# Altium schematic sheet Mother_board_main.SchDoc
size 410 x 297 mm
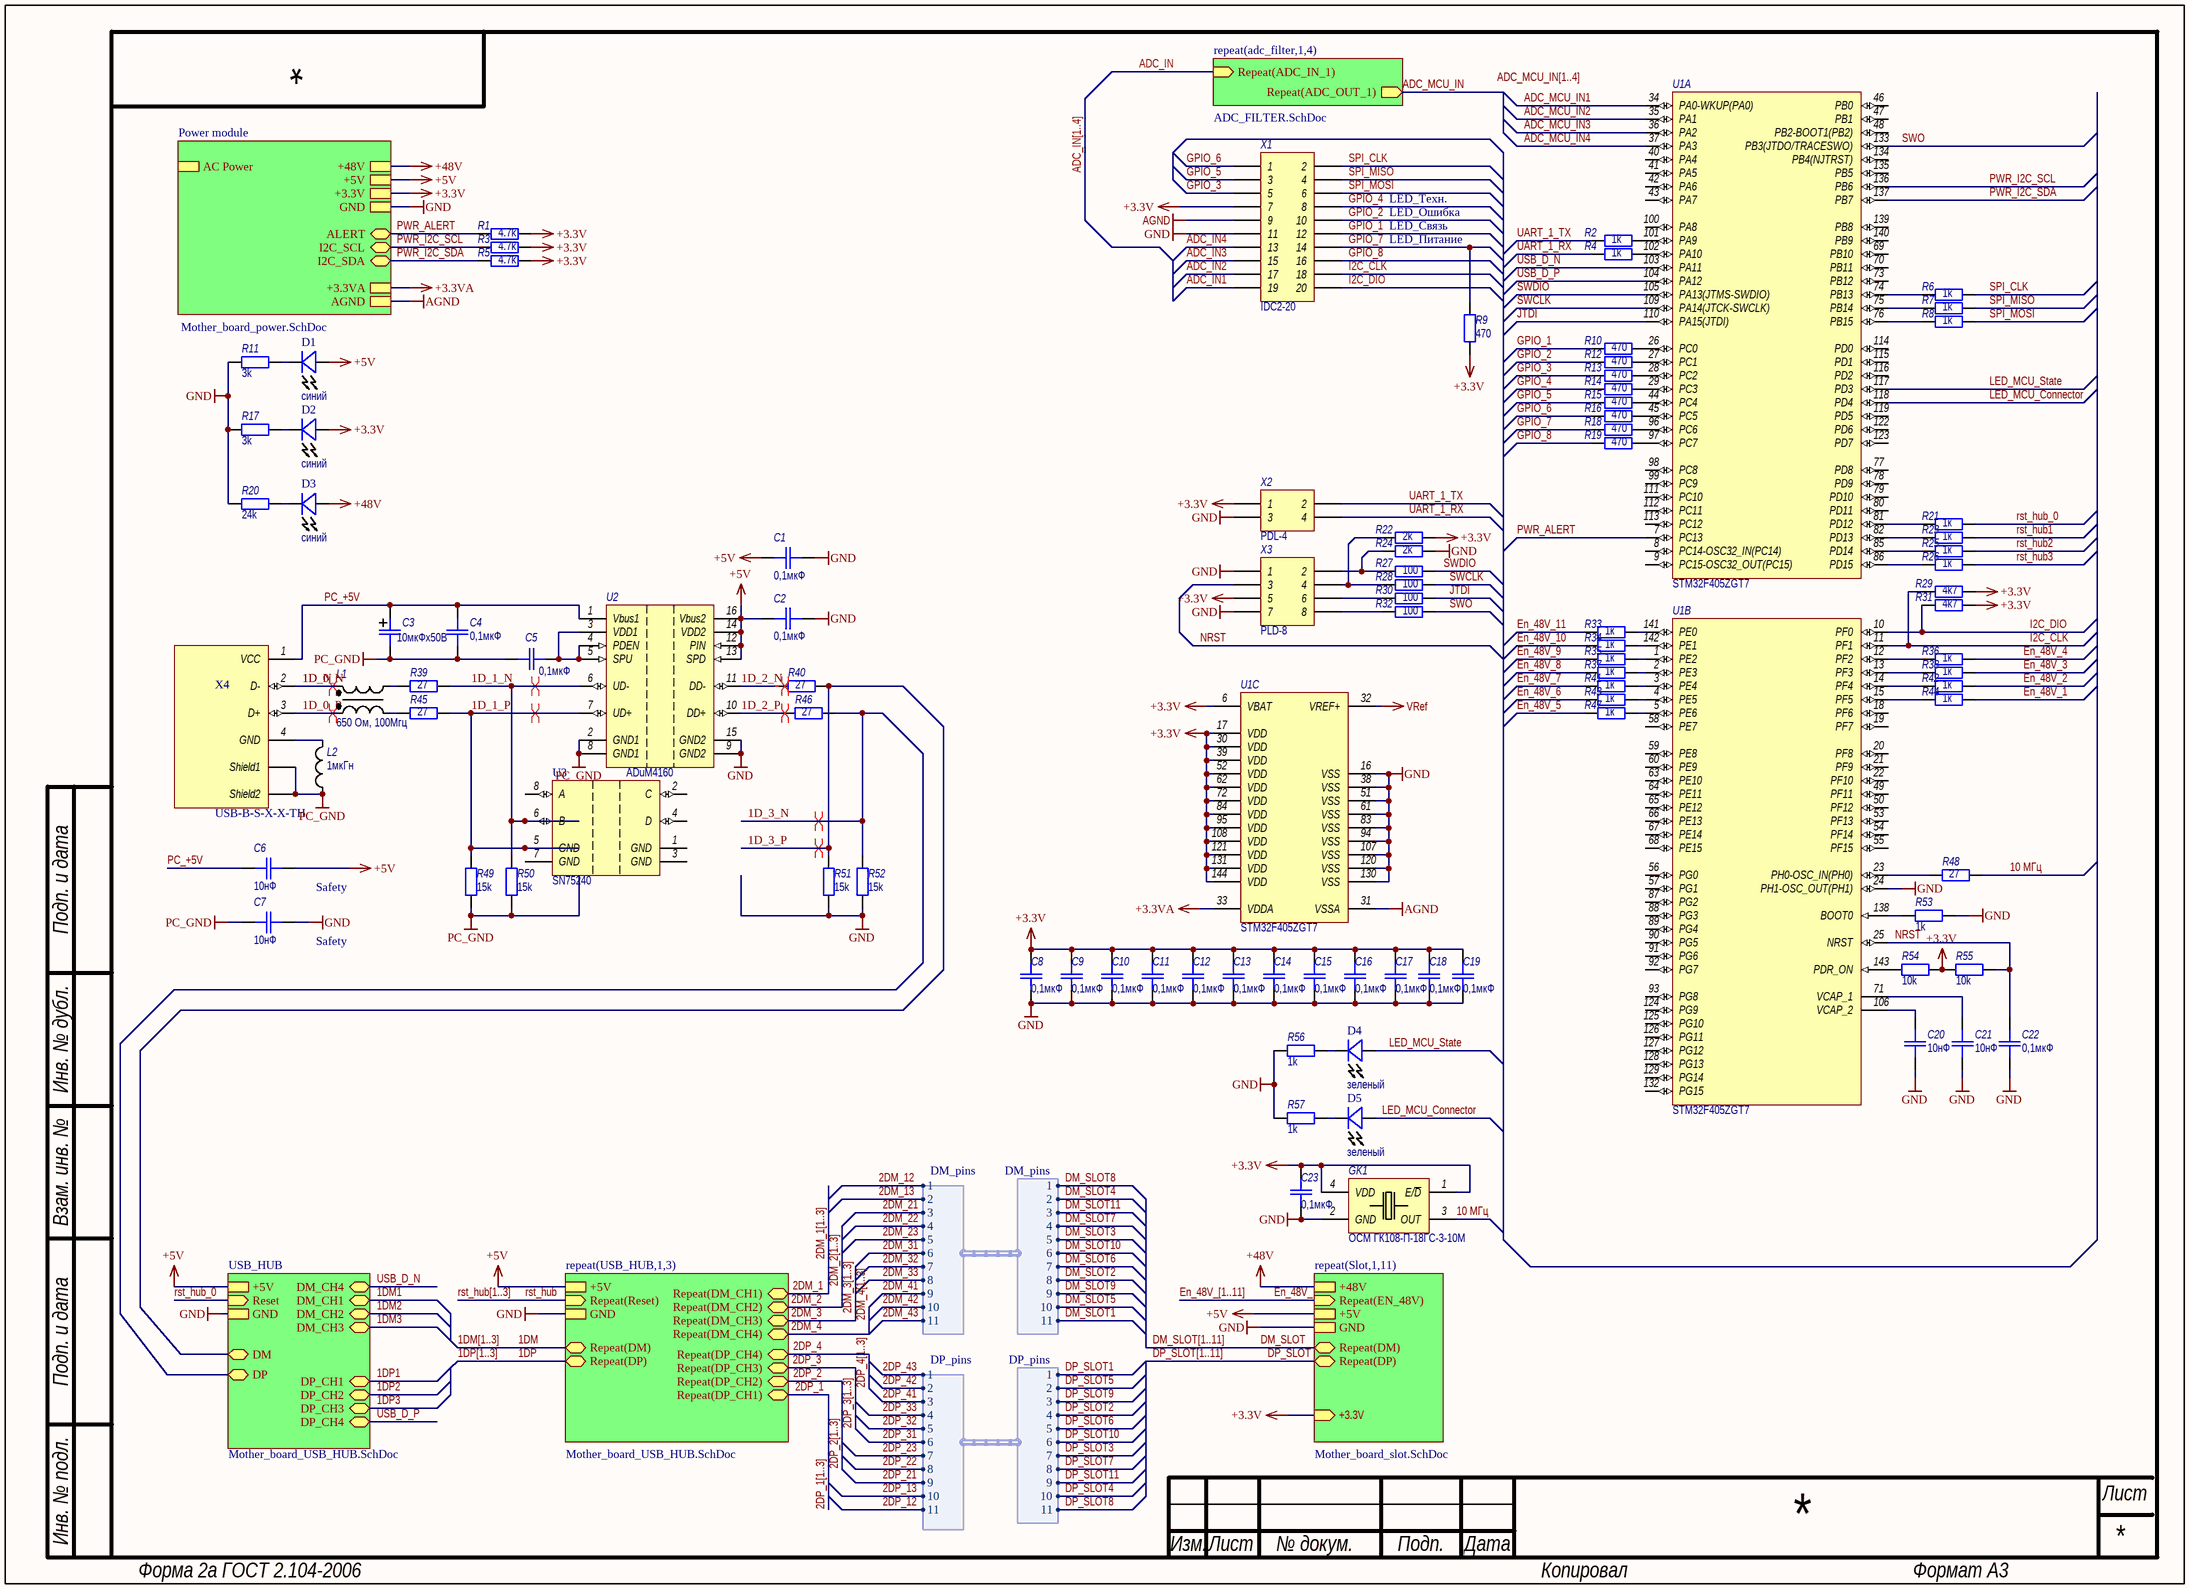
[diagram p0: Mother_board_main.SchDoc]

## Parts
C1  0,1мкФ  [SMD_0805]
C2  0,1мкФ  [SMD_0805]
C3  10мкФх50В  [SMD_size_B]
C4  0,1мкФ  [SMD_0805]
C5  0,1мкФ  [SMD_0805]
C6  10нФ  [SMD_0805]
C7  10нФ  [SMD_0805]
C8  0,1мкФ  [SMD_0805]
C9  0,1мкФ  [SMD_0805]
C10  0,1мкФ  [SMD_0805]
C11  0,1мкФ  [SMD_0805]
C12  0,1мкФ  [SMD_0805]
C13  0,1мкФ  [SMD_0805]
C14  0,1мкФ  [SMD_0805]
C15  0,1мкФ  [SMD_0805]
C16  0,1мкФ  [SMD_0805]
C17  0,1мкФ  [SMD_0805]
C18  0,1мкФ  [SMD_0805]
C19  0,1мкФ  [SMD_0805]
C20  10нФ  [SMD_0805]
C21  10нФ  [SMD_0805]
C22  0,1мкФ  [SMD_0805]
C23  0,1мкФ  [SMD_0805]
D1  value синий  [LED-0805]  (hidden comment: LED)
D2  value синий  [LED-0805]  (hidden comment: LED)
D3  value синий  [LED-0805]  (hidden comment: LED)
D4  value зеленый  [LED-0805+circle]  (hidden comment: LED)
D5  value зеленый  [LED-0805+circle]  (hidden comment: LED)
GK1  Наименование: ОСМ ГК108-П-18ГС-3-10М  [SMD_7050_Crystal_Oscillator]  (hidden comment: GK108-P)
L1  650 Ом, 100Мгц  [ACM2012]
L2  1мкГн  [SMD_0805]
R1  4.7k  [SMD_0805]
R2  1k  [SMD_0805]
R3  4.7k  [SMD_0805]
R4  1k  [SMD_0805]
R5  4.7k  [SMD_0805]
R6  1k  [SMD_0805]
R7  1k  [SMD_0805]
R8  1k  [SMD_0805]
R9  470  [SMD_0805]
R10  470  [SMD_0805]
R11  3k  [SMD_0805]
R12  470  [SMD_0805]
R13  470  [SMD_0805]
R14  470  [SMD_0805]
R15  470  [SMD_0805]
R16  470  [SMD_0805]
R17  3k  [SMD_0805]
R18  470  [SMD_0805]
R19  470  [SMD_0805]
R20  24k  [SMD_0805]
R21  1к  [SMD_0805]
R22  2k  [SMD_0805]
R23  1к  [SMD_0805]
R24  2k  [SMD_0805]
R25  1к  [SMD_0805]
R26  1к  [SMD_0805]
R27  100  [SMD_0805]
R28  100  [SMD_0805]
R29  4k7  [SMD_0805]
R30  100  [SMD_0805]
R31  4k7  [SMD_0805]
R32  100  [SMD_0805]
R33  1к  [SMD_0805]
R34  1к  [SMD_0805]
R35  1к  [SMD_0805]
R36  1к  [SMD_0805]
R37  1к  [SMD_0805]
R38  1к  [SMD_0805]
R39  27  [SMD_0805]
R40  27  [SMD_0805]
R41  1к  [SMD_0805]
R42  1к  [SMD_0805]
R43  1к  [SMD_0805]
R44  1к  [SMD_0805]
R45  27  [SMD_0805]
R46  27  [SMD_0805]
R47  1к  [SMD_0805]
R48  27  [SMD_0805]
R49  15k  [SMD_0805]
R50  15k  [SMD_0805]
R51  15k  [SMD_0805]
R52  15k  [SMD_0805]
R53  1k  [SMD_0805]
R54  10k  [SMD_0805]
R55  10k  [SMD_0805]
R56  1k  [SMD_0805]
R57  1k  [SMD_0805]
U1  STM32F405ZGT7  [LQFP144]  (parts A,B,C of 3)
U2  ADuM1402  [SOIC-16-WIDE]  (value not drawn)
U3  SN75240  [SN75240]
X1  Наименование: IDC2-20  [PLD2-20]  (hidden comment: Header 2X20)
X2  Наименование: PDL-4  [PBD-4]  (hidden comment: Header 2X4)
X3  Наименование: PLD-8  [PBD-8]  (hidden comment: Header 2X8)
X4  USB-B-S-X-X-TH  [*SAMTEC_USB-B-S-X-X-TH_USB-B-S-X-X-TH(Primary)]

## Sub-sheets
Power module = Mother_board_power.SchDoc: AC Power (harness AC Power), I2C_SCL (bidir), I2C_SDA (bidir), ALERT (bidir), +5V, +48V, +3.3V, GND, +3.3VA, AGND
repeat(adc_filter,1,4) = ADC_FILTER.SchDoc: Repeat(ADC_OUT_1) (out), Repeat(ADC_IN_1) (in)
repeat(Slot,1,11) = Mother_board_slot.SchDoc: Repeat(DM) (bidir), Repeat(EN_48V) (in), Repeat(DP) (bidir), +48V, +5V, GND, +3.3V (in)
repeat(USB_HUB,1,3) = Mother_board_USB_HUB.SchDoc: Repeat(Reset) (in), Repeat(DP) (bidir), Repeat(DM) (bidir), Repeat(DP_CH1) (bidir), Repeat(DP_CH2) (bidir), Repeat(DP_CH3) (bidir), Repeat(DP_CH4) (bidir), Repeat(DM_CH1) (bidir), Repeat(DM_CH2) (bidir), Repeat(DM_CH3) (bidir), Repeat(DM_CH4) (bidir), +5V, GND
USB_HUB = Mother_board_USB_HUB.SchDoc: Reset (in), DP (bidir), DM (bidir), DP_CH1 (bidir), DP_CH2 (bidir), DP_CH3 (bidir), DP_CH4 (bidir), DM_CH1 (bidir), DM_CH2 (bidir), DM_CH3 (bidir), DM_CH4 (bidir), GND, +5V

## Harnesses
DM_pins: 1, 2, 3, 4, 5, 6, 7, 8, 9, 10, 11
DP_pins: 1, 2, 3, 4, 5, 6, 7, 8, 9, 10, 11

## Nets
+3.3V: C8.2 C9.2 C10.2 C11.2 C12.2 C13.2 C14.2 C15.2 C16.2 C17.2 C18.2 C19.2 C23.2 D2.1(A) GK1.1(E/~{D}) GK1.4(VDD) R1.1 R3.1 R5.1 R9.1 R22.2 R29.2 R31.2 R54.1 R55.2 U1.6(VBAT) U1.17(VDD) U1.30(VDD) U1.39(VDD) U1.52(VDD) U1.62(VDD) U1.72(VDD) U1.84(VDD) U1.95(VDD) U1.108(VDD) U1.121(VDD) U1.131(VDD) U1.144(VDD) X1.7 X2.1 X3.5 ; sheet Power module/+3.3V, sheet repeat(Slot,1,11)/+3.3V
+3.3VA: U1.33(VDDA) ; sheet Power module/+3.3VA
+5V: C1.2 C2.2 C6.2 D1.1(A) U2.12(PIN) U2.13(SPD) U2.14(VDD2) U2.16(Vbus2) ; sheet Power module/+5V, sheet repeat(USB_HUB,1,3)/+5V, sheet repeat(Slot,1,11)/+5V, sheet USB_HUB/+5V
+48V: D3.1(A) ; sheet Power module/+48V, sheet repeat(Slot,1,11)/+48V
AGND: U1.31(VSSA) X1.9 ; sheet Power module/AGND
GND: C1.1 C2.1 C7.2 C8.1 C9.1 C10.1 C11.1 C12.1 C13.1 C14.1 C15.1 C16.1 C17.1 C18.1 C19.1 C20.1 C21.1 C22.1 C23.1 GK1.2(GND) R11.1 R17.1 R20.1 R24.2 R51.2 R52.2 R53.1 R56.1 R57.1 U1.16(VSS) U1.24(PH1-OSC_OUT(PH1)) U1.38(VSS) U1.51(VSS) U1.61(VSS) U1.83(VSS) U1.94(VSS) U1.107(VSS) U1.120(VSS) U1.130(VSS) U2.9(GND2) U2.15(GND2) X1.11 X2.3 X3.1 X3.7 ; sheet Power module/GND, sheet repeat(USB_HUB,1,3)/GND, sheet repeat(Slot,1,11)/GND, sheet USB_HUB/GND
PC_GND: C3.2 C4.2 C5.1 C7.1 L2.1 R49.1 R50.1 U2.2(GND1) U2.8(GND1) X4.S1(Shield1) X4.S2(Shield2)
VRef: U1.32(VREF+)
1D_0_N: L1.2 X4.2(D-)  [also labelled 1D_N]
1D_0_P: L1.3 X4.3(D+)
1D_1_N: R39.2 R50.2 U2.6(UD-) U3.6(B)
1D_1_P: R45.2 R49.2 U2.7(UD+) U3.5(GND)
1D_2_N: R40.1 U2.11(DD-)
1D_2_P: R46.1 U2.10(DD+)
1D_3_N: R46.2 R52.1 ; sheet USB_HUB/DP
1D_3_P: R40.2 R51.1 ; sheet USB_HUB/DM
1DM: sheet repeat(USB_HUB,1,3)/Repeat(DM)
1DM1: sheet USB_HUB/DM_CH1
1DM2: sheet USB_HUB/DM_CH2
1DM3: sheet USB_HUB/DM_CH3
1DP: sheet repeat(USB_HUB,1,3)/Repeat(DP)
1DP1: sheet USB_HUB/DP_CH1
1DP2: sheet USB_HUB/DP_CH2
1DP3: sheet USB_HUB/DP_CH3
2DM_1: sheet repeat(USB_HUB,1,3)/Repeat(DM_CH1)
2DM_2: sheet repeat(USB_HUB,1,3)/Repeat(DM_CH2)
2DM_3: sheet repeat(USB_HUB,1,3)/Repeat(DM_CH3)
2DM_4: sheet repeat(USB_HUB,1,3)/Repeat(DM_CH4)
2DM_12: harness DM_pins.1  [also labelled DM_SLOT8]
2DM_13: harness DM_pins.2  [also labelled DM_SLOT4]
2DM_21: harness DM_pins.3  [also labelled DM_SLOT11]
2DM_22: harness DM_pins.4  [also labelled DM_SLOT7]
2DM_23: harness DM_pins.5  [also labelled DM_SLOT3]
2DM_31: harness DM_pins.6  [also labelled DM_SLOT10]
2DM_32: harness DM_pins.7  [also labelled DM_SLOT6]
2DM_33: harness DM_pins.8  [also labelled DM_SLOT2]
2DM_41: harness DM_pins.9  [also labelled DM_SLOT9]
2DM_42: harness DM_pins.10  [also labelled DM_SLOT5]
2DM_43: harness DM_pins.11  [also labelled DM_SLOT1]
2DP_1: sheet repeat(USB_HUB,1,3)/Repeat(DP_CH1)
2DP_2: sheet repeat(USB_HUB,1,3)/Repeat(DP_CH2)
2DP_3: sheet repeat(USB_HUB,1,3)/Repeat(DP_CH3)
2DP_4: sheet repeat(USB_HUB,1,3)/Repeat(DP_CH4)
2DP_12: harness DP_pins.11  [also labelled DP_SLOT8]
2DP_13: harness DP_pins.10  [also labelled DP_SLOT4]
2DP_21: harness DP_pins.9  [also labelled DP_SLOT11]
2DP_22: harness DP_pins.8  [also labelled DP_SLOT7]
2DP_23: harness DP_pins.7  [also labelled DP_SLOT3]
2DP_31: harness DP_pins.6  [also labelled DP_SLOT10]
2DP_32: harness DP_pins.5  [also labelled DP_SLOT6]
2DP_33: harness DP_pins.4  [also labelled DP_SLOT2]
2DP_41: harness DP_pins.3  [also labelled DP_SLOT9]
2DP_42: harness DP_pins.2  [also labelled DP_SLOT5]
2DP_43: harness DP_pins.1  [also labelled DP_SLOT1]
10 МГц: GK1.3(OUT) R48.1
ADC_IN: sheet repeat(adc_filter,1,4)/Repeat(ADC_IN_1)
ADC_IN1: X1.19
ADC_IN2: X1.17
ADC_IN3: X1.15
ADC_IN4: X1.13
ADC_MCU_IN: sheet repeat(adc_filter,1,4)/Repeat(ADC_OUT_1)
ADC_MCU_IN1: U1.34(PA0-WKUP(PA0))
ADC_MCU_IN2: U1.35(PA1)
ADC_MCU_IN3: U1.36(PA2)
ADC_MCU_IN4: U1.37(PA3)
DM_SLOT: sheet repeat(Slot,1,11)/Repeat(DM)
DP_SLOT: sheet repeat(Slot,1,11)/Repeat(DP)
En_48V_: sheet repeat(Slot,1,11)/Repeat(EN_48V)  [also labelled En_48V_[1..11]]
En_48V_1: R44.1
En_48V_2: R42.1
En_48V_3: R38.1
En_48V_4: R36.1
En_48V_5: R47.2
En_48V_6: R43.2
En_48V_7: R41.2
En_48V_8: R37.2
En_48V_9: R35.2
En_48V_10: R34.2
En_48V_11: R33.2
GPIO_1: R10.1 X1.12
GPIO_2: R12.1 X1.10
GPIO_3: R13.1 X1.5
GPIO_4: R14.1 X1.8
GPIO_5: R15.1 X1.3
GPIO_6: R16.1 X1.1
GPIO_7: R9.2 R18.1 X1.14
GPIO_8: R19.1 X1.16
I2C_CLK: R29.1 U1.11(PF1) X1.18
I2C_DIO: R31.1 U1.10(PF0) X1.20
JTDI: R30.2 U1.110(PA15(JTDI))
LED_MCU_Connector: D5.1(A) U1.118(PD4)
LED_MCU_State: D4.1(A) U1.117(PD3)
NRST: C22.2 R55.1 U1.25(NRST) X3.3
PC_+5V: C3.1 C4.1 C6.1 U2.1(Vbus1) X4.1(VCC)
PWR_ALERT: R1.2 U1.7(PC13) ; sheet Power module/ALERT
PWR_I2C_SCL: R3.2 U1.136(PB6) ; sheet Power module/I2C_SCL
PWR_I2C_SDA: R5.2 U1.137(PB7) ; sheet Power module/I2C_SDA
rst_hub: sheet repeat(USB_HUB,1,3)/Repeat(Reset)
rst_hub1: R23.1
rst_hub2: R25.1
rst_hub3: R26.1
rst_hub_0: R21.1 ; sheet USB_HUB/Reset
SPI_CLK: R6.2 X1.2
SPI_MISO: R7.2 X1.4
SPI_MOSI: R8.2 X1.6
SWCLK: R28.2 U1.109(PA14(JTCK-SWCLK))
SWDIO: R27.2 U1.105(PA13(JTMS-SWDIO))
SWO: R32.2 U1.133(PB3(JTDO/TRACESWO))
UART_1_RX: R4.1 X2.4
UART_1_TX: R2.1 X2.2
USB_D_N: U1.103(PA11) ; sheet USB_HUB/DM_CH4
USB_D_P: U1.104(PA12) ; sheet USB_HUB/DP_CH4
NetC5_2: C5.2 U2.3(VDD1) U2.4(PDEN) U2.5(SPU)
NetC20_2: C20.2 U1.106(VCAP_2)
NetC21_2: C21.2 U1.71(VCAP_1)
NetD1_2: D1.2(K) R11.2
NetD2_2: D2.2(K) R17.2
NetD3_2: D3.2(K) R20.2
NetD4_2: D4.2(K) R56.2
NetD5_2: D5.2(K) R57.2
NetL1_1: L1.1 R39.1
NetL1_4: L1.4 R45.1
NetL2_2: L2.2 X4.4(GND)
NetR2_2: R2.2 U1.101(PA9)
NetR4_2: R4.2 U1.102(PA10)
NetR6_1: R6.1 U1.74(PB13)
NetR7_1: R7.1 U1.75(PB14)
NetR8_1: R8.1 U1.76(PB15)
NetR10_2: R10.2 U1.26(PC0)
NetR12_2: R12.2 U1.27(PC1)
NetR13_2: R13.2 U1.28(PC2)
NetR14_2: R14.2 U1.29(PC3)
NetR15_2: R15.2 U1.44(PC4)
NetR16_2: R16.2 U1.45(PC5)
NetR18_2: R18.2 U1.96(PC6)
NetR19_2: R19.2 U1.97(PC7)
NetR21_2: R21.2 U1.81(PD12)
NetR22_1: R22.1 R28.1 X3.4
NetR23_2: R23.2 U1.82(PD13)
NetR24_1: R24.1 R27.1 X3.2
NetR25_2: R25.2 U1.85(PD14)
NetR26_2: R26.2 U1.86(PD15)
NetR30_1: R30.1 X3.6
NetR32_1: R32.1 X3.8
NetR33_1: R33.1 U1.141(PE0)
NetR34_1: R34.1 U1.142(PE1)
NetR35_1: R35.1 U1.1(PE2)
NetR36_2: R36.2 U1.12(PF2)
NetR37_1: R37.1 U1.2(PE3)
NetR38_2: R38.2 U1.13(PF3)
NetR41_1: R41.1 U1.3(PE4)
NetR42_2: R42.2 U1.14(PF4)
NetR43_1: R43.1 U1.4(PE5)
NetR44_2: R44.2 U1.15(PF5)
NetR47_1: R47.1 U1.5(PE6)
NetR48_2: R48.2 U1.23(PH0-OSC_IN(PH0))
NetR53_2: R53.2 U1.138(BOOT0)
NetR54_2: R54.2 U1.143(PDR_ON)

Not connected (* = marked no-connect by the designer): U1 8(PC14-OSC32_IN(PC14)) 9(PC15-OSC32_OUT(PC15)) 18(PF6) 19(PF7) 20(PF8) 21(PF9) 22(PF10) 40(PA4) 41(PA5) 42(PA6) 43(PA7) 46(PB0) 47(PB1) 48(PB2-BOOT1(PB2)) 49(PF11) 50(PF12) 53(PF13) 54(PF14) 55(PF15) 56(PG0) 57(PG1) 58(PE7) 59(PE8) 60(PE9) 63(PE10) 64(PE11) 65(PE12) 66(PE13) 67(PE14) 68(PE15) 69(PB10) 70(PB11) 73(PB12) 77(PD8) 78(PD9) 79(PD10) 80(PD11) 87(PG2) 88(PG3) 89(PG4) 90(PG5) 91(PG6) 92(PG7) 93(PG8) 98(PC8) 99(PC9) 100(PA8) 111(PC10) 112(PC11) 113(PC12) 114(PD0) 115(PD1) 116(PD2) 119(PD5) 122(PD6) 123(PD7) 124(PG9) 125(PG10) 126(PG11) 127(PG12) 128(PG13) 129(PG14) 132(PG15) 134(PB4(NJTRST)) 135(PB5) 139(PB8) 140(PB9); U3 1(GND) 2(C) 3(GND) 4(D) 7(GND) 8(A)

## Buses and harness runs
bus 1DM[1..3]
bus 1DP[1..3]
bus 2DM_1[1..3]
bus 2DM_2[1..3]
bus 2DM_3[1..3]
bus 2DM_4[1..3]
bus 2DP_1[1..3]
bus 2DP_2[1..3]
bus 2DP_3[1..3]
bus 2DP_4[1..3]
bus ADC_IN[1..4]
bus ADC_MCU_IN[1..4]
bus DM_SLOT[1..11]
bus DP_SLOT[1..11]
bus rst_hub[1..3]

## Layout directives
differential pair: 1D_0_N, 1D_0_P, 1D_1_N, 1D_1_P, 1D_2_N, 1D_2_P, 1D_3_N, 1D_3_P

## Notes on the sheet
- LED_Питание
- LED_Техн.
- LED_Связь
- LED_Ошибка
- Safety
- (near C7) Safety
- Labels drawn without touching a wire or pin: ADC_MCU_IN[1..4]
- Подп. и дата
- Инв. № дубл.
- Взам. инв. №
- Инв. № подл.
- Изм.
- Лист
- № докум.
- Подп.
- Дата
- Форма 2а ГОСТ 2.104-2006
- Копировал
- Формат А3

## Library data of the parts
C1 C2 C4-C23 = Capacitor: Назначение: SMD-конденсатор; Наименование: Конденсатор; Потребление, Вт: 0
  C1 C2 C4 C5 C8-C19 C22 C23: Value: 0,1мкФ
  C6 C7 C20 C21: Value: 10нФ
C3 = Capacitor_pol: Polarized capacitor; Назначение: Поляризованный SMD-конденсатор; Наименование: Поляризованный конденсатор; Потребление, Вт: 0; Value: 10мкФх50В
D1-D5 = LED: Назначение: Светодиод; Наименование: SMD-LED; Потребление, Вт: 0,01
GK1 = Crystal_Oscillator: Crystall oscillator, CMOS, 3.3V, SMD7050; Назначение: Кварцевый генератор; Потребление, Вт: 0,165; ComponentLink1Description: DataSheet; ComponentLink1URL: http://www.lit-phonon.ru/downloads/GK108-P.pdf
L1 = Inductor_coupled: Coupled inductor; Назначение: Связанная индуктивность; Наименование: PLT10HH1026R0PN; Потребление, Вт: 0,1; Value: 650 Ом, 100Мгц
L2 = Inductor: Наименование: Индуктивность; Назначение: SMD-индуктивность; Потребление, Вт: 0,010; Value: 1мкГн
R1-R57 = Resistor: Наименование: Резистор; Назначение: SMD-резистор; Потребление, Вт: 0,001
  R1 R3 R5: Value: 4.7k
  R2 R4 R6-R8 R53 R56 R57: Value: 1k
  R9 R10 R12-R16 R18 R19: Value: 470
  R11 R17: Value: 3k
  R20: Value: 24k
  R21 R23 R25 R26 R33-R38 R41-R44 R47: Value: 1к
  R22 R24: Value: 2k
  R27 R28 R30 R32: Value: 100
  R29 R31: Value: 4k7
  R39 R40 R45 R46 R48: Value: 27
  R49-R52: Value: 15k
  R54 R55: Value: 10k
U1 = STM32F405ZGT: ARM Cortex-M4 32-bit MCU+FPU, 210 DMIPS, 1024 kB Flash, 192 kB Internal RAM, 114 I/Os, 144-pin LQFP, -40 to 105 degC, Tray; Потребление, Вт: 0.2; Назначение: ARM Cortex-M4 32-bit MCU+FPU; ComponentLink1Description: Datasheet; ComponentLink1URL: http://www.st.com/st-web-ui/static/active/en/resource/technical/document/datasheet/DM00037051.pdf; DataSheet: https://www.st.com/content/ccc/resource/technical/document/reference_manual/3d/6d/5a/66/b4/99/40/d4/DM00031020.pdf/files/DM00031020.pdf/jcr:content/translations/en.DM00031020.pdf; HalManual: https://www.st.com/resource/en/user_manual/dm00105879-description-of-stm32f4-hal-and-ll-drivers-stmicroelectronics.pdf; Наименование: STM32F405ZGT7
U2 = ADuM4160: Quad Channel Digital Isolator, 2.5 KV rms Insulation Rating; Назначение: цифровой изолятор шины USB; Потребление, Вт: 0,025; DataSheet: https://www.analog.com/media/en/technical-documentation/data-sheets/ADuM4160.pdf; UserGuide: https://www.analog.com/media/en/reference-design-documentation/reference-designs/CN0160.pdf; Наименование: ADuM4160
U3 = SN75240: ESD-защита; Потребление, Вт: 0; Назначение: ESD-защита; Наименование: SN75240
X1 = Header 2X20: Header, 20-Pin, Dual row; Потребление, Вт: 0,0; Назначение: Header, 20-Pin, Dual row
X2 = Header 2X4: Header, 4-Pin, Dual row; Потребление, Вт: 0,0; Назначение: Header, 4-Pin, Dual row
X3 = Header 2X8: Header, 8-Pin, Dual row; Потребление, Вт: 0,0; Назначение: Header, 8-Pin, Dual row
X4 = USB-B-S-X-X-TH: USB-B (USB TYPE-B) USB 2.0 Receptacle Connector 4 Position Through Hole, Right Angle; MP: USB-B-S-F-B-TH; Потребление, Вт: 0; Назначение: USB соединитель; Availability: Bad; BuyPart: https://www.snapeda.com/parts/USB-B-S-F-B-TH/Samtec%20Inc./view-part/226211/?ref=eda; Toby_UK-Purchase-URL: https://snapeda.com/shop?store=Toby+UK&id=226211; SnapEDA_Link: https://www.snapeda.com/parts/USB-B-S-F-B-TH/Samtec%20Inc./view-part/226211/?ref=snap; Value: *; Наименование: USB-B